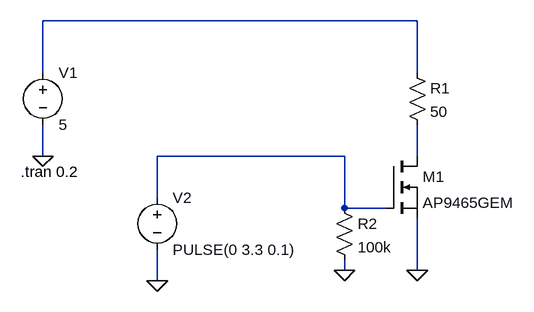
[diagram p0: schematic EnableDcDc.asc]
EnableDcDc.asc, the LTspice schematic file:
Version 4
SHEET 1 880 680
WIRE 304 64 -272 64
WIRE -272 144 -272 64
WIRE 304 144 304 64
WIRE -272 272 -272 224
WIRE 192 272 -96 272
WIRE 304 272 304 224
WIRE -96 336 -96 272
WIRE 192 352 192 272
WIRE 256 352 192 352
WIRE 192 448 192 432
WIRE 304 448 304 368
WIRE -96 464 -96 416
FLAG -272 272 0
FLAG -96 464 0
FLAG 304 448 0
FLAG 192 448 0
SYMBOL res 288 128 R0
SYMATTR InstName R1
SYMATTR Value 50
SYMBOL voltage -272 128 R0
SYMATTR InstName V1
SYMATTR Value 5
SYMBOL voltage -96 320 R0
WINDOW 123 0 0 Left 0
WINDOW 39 0 0 Left 0
SYMATTR InstName V2
SYMATTR Value PULSE(0 3.3 0.1)
SYMBOL nmos 256 272 R0
SYMATTR InstName M1
SYMATTR Value AP9465GEM
SYMBOL res 176 336 R0
SYMATTR InstName R2
SYMATTR Value 100k
TEXT -306 296 Left 2 !.tran 0.2

The netlist it stands for:
* EnableDcDc.asc
R1 N001 N003 50
V1 N001 0 5
V2 N002 0 PULSE(0 3.3 0.1)
M1 N003 N002 0 0 AP9465GEM
R2 N002 0 100k
.model NMOS NMOS
.model PMOS PMOS
.lib standard.mos
.tran 0.2
.backanno
.end